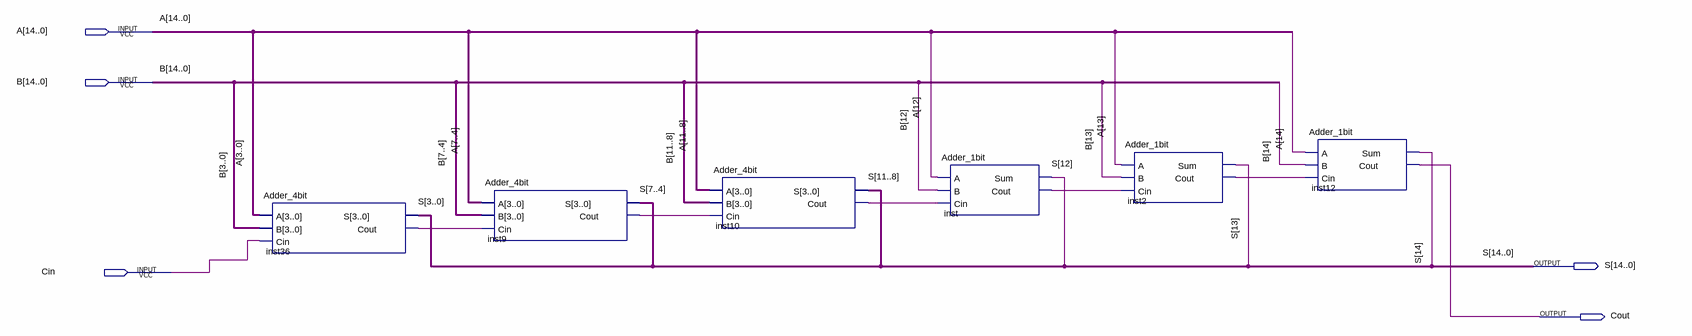
[diagram p0: schematic sheet]
// Quartus schematic Adder_15bit.bdf as structural Verilog: 6 symbols, 5 pins
module Adder_15bit (
  input  [14:0] A,
  input  [14:0] B,
  input  Cin,
  output [14:0] S,
  output Cout
);

  wire inst2_cout, inst9_cout, inst10_cout, inst36_cout, inst_cout;

  Adder_4bit inst36 (.A(A[3:0]), .B(B[3:0]), .Cin(Cin), .S(S[3:0]), .Cout(inst36_cout));
  Adder_4bit inst9 (.A(A[7:4]), .B(B[7:4]), .Cin(inst36_cout), .S(S[7:4]), .Cout(inst9_cout));
  Adder_4bit inst10 (.A(A[11:8]), .B(B[11:8]), .Cin(inst9_cout), .S(S[11:8]), .Cout(inst10_cout));
  Adder_1bit inst (.A(A[12]), .B(B[12]), .Cin(inst10_cout), .Sum(S[12]), .Cout(inst_cout));
  Adder_1bit inst2 (.A(A[13]), .B(B[13]), .Cin(inst_cout), .Sum(S[13]), .Cout(inst2_cout));
  Adder_1bit inst12 (.A(A[14]), .B(B[14]), .Cin(inst2_cout), .Sum(S[14]), .Cout(Cout));
endmodule
